# Altium schematic sheet L-Stick_sheet2_mcu.SchDoc: L-Stick - nRF MCU
size A4; DocumentNumber: 2; Revision: 1.0.0; SheetNumber: 2; SheetTotal: 5; DrawnBy: SU; DocumentSize: A4; PCAName: L-Stick
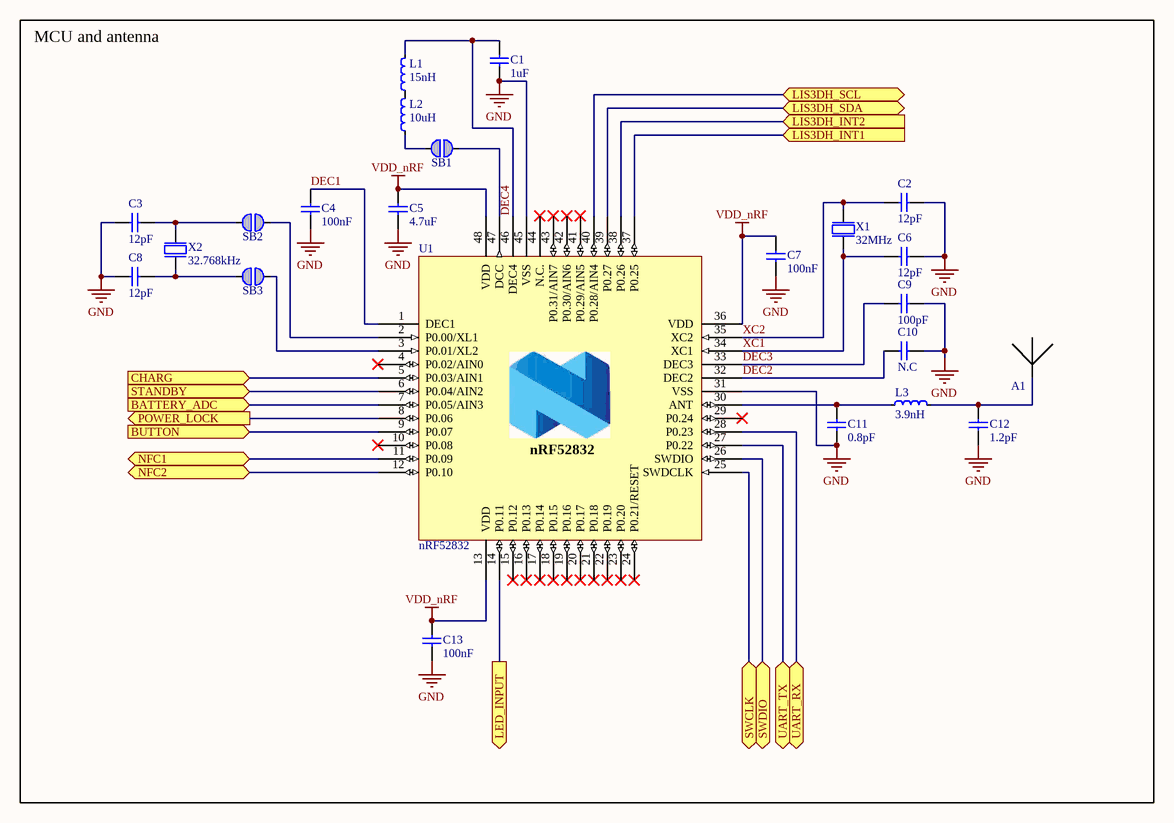
[diagram p0: L-Stick_sheet2_mcu.SchDoc]

## Parts
A1  (no value)  [Antenna]  (no BOM)
C1  1uF  [0603C]
C2  12pF  [0402C]
C3  12pF  [0402C]
C4  100nF  [0402C]
C5  4.7uF  [0603C]
C6  12pF  [0402C]
C7  100nF  [0402C]
C8  12pF  [0402C]
C9  100pF  [0402C]
C10  N.C  [0402C]
C11  0.8pF  [0402C]
C12  1.2pF  [0402C]
C13  100nF  [0402C]
L1  15nH  [0402L]
L2  10uH  [0603L]
L3  3.9nH  [0402L]
SB1  Solderbridge  [Solderbridge]  (value not drawn)  (no BOM)
SB2  Solderbridge  [Solderbridge]  (value not drawn)  (no BOM)
SB3  Solderbridge  [Solderbridge]  (value not drawn)  (no BOM)
U1  nRF52832  [QFN40P600X600X90-48N]
X1  32MHz  [XTAL_2016]
X2  32.768kHz  [XTAL_2012]

## Blocks framed on the sheet
MCU and antenna: A1 C1-C13 L1-L3 SB1-SB3 U1 X1 X2

## Ports
BATTERY_ADC (in), BUTTON (in), CHARG (in), LED_INPUT (out), LIS3DH_INT1 (in), LIS3DH_INT2 (in), LIS3DH_SCL (bidir), LIS3DH_SDA (bidir), NFC1 (bidir), NFC2 (bidir), POWER_LOCK (out), STANDBY (in), SWCLK (bidir), SWDIO (bidir), UART_RX (bidir), UART_TX (bidir)

## Nets
GND: C1.1 C2.2 C3.1 C4.1 C5.1 C6.2 C7.1 C8.1 C9.2 C10.2 C11.1 C12.1 C13.1 U1.31(VSS) U1.45(VSS) U1.49(GND) X1.2(GND) X1.4(GND)
VDD_nRF: C5.2 C7.2 C13.2 U1.13(VDD) U1.36(VDD) U1.48(VDD)
BATTERY_ADC: U1.7(P0.05/AIN3) ; port BATTERY_ADC
BUTTON: U1.9(P0.07) ; port BUTTON
CHARG: U1.5(P0.03/AIN1) ; port CHARG
DEC1: C4.2 U1.1(DEC1)
DEC2: C10.1 U1.32(DEC2)
DEC3: C9.1 U1.33(DEC3)
DEC4: C1.2 L1.2 U1.46(DEC4)
LED_INPUT: U1.14(P0.11) ; port LED_INPUT
LIS3DH_INT1: U1.37(P0.25) ; port LIS3DH_INT1
LIS3DH_INT2: U1.38(P0.26) ; port LIS3DH_INT2
LIS3DH_SCL: U1.40(P0.28/AIN4) ; port LIS3DH_SCL
LIS3DH_SDA: U1.39(P0.27) ; port LIS3DH_SDA
NFC1: U1.11(P0.09) ; port NFC1
NFC2: U1.12(P0.10) ; port NFC2
POWER_LOCK: U1.8(P0.06) ; port POWER_LOCK
STANDBY: U1.6(P0.04/AIN2) ; port STANDBY
SWCLK: U1.25(SWDCLK) ; port SWCLK
SWDIO: U1.26(SWDIO) ; port SWDIO
UART_RX: U1.28(P0.23) ; port UART_RX
UART_TX: U1.27(P0.22) ; port UART_TX
XC1: C6.1 U1.34(XC1) X1.1(inp)
XC2: C2.1 U1.35(XC2) X1.3(out)
NetA1_1: A1.1 C12.2 L3.2
NetC3_2: C3.2 SB2.1 X2.2(out)
NetC8_2: C8.2 SB3.1 X2.1(inp)
NetC11_2: C11.2 L3.1 U1.30(ANT)
NetL1_1: L1.1 L2.2
NetL2_1: L2.1 SB1.1
NetSB1_2: SB1.2 U1.47(DCC)
NetSB2_2: SB2.2 U1.2(P0.00/XL1)
NetSB3_2: SB3.2 U1.3(P0.01/XL2)

Not connected (* = marked no-connect by the designer): U1 4(P0.02/AIN0)* 10(P0.08)* 15(P0.12)* 16(P0.13)* 17(P0.14)* 18(P0.15)* 19(P0.16)* 20(P0.17)* 21(P0.18)* 22(P0.19)* 23(P0.20)* 24(P0.21/RESET)* 29(P0.24)* 41(P0.29/AIN5)* 42(P0.30/AIN6)* 43(P0.31/AIN7)* 44(N.C.)*

## Notes on the sheet
- Title
- Size:
- Date:
- A4
- Number:
- Time:
- Revision:
- Sheet
- of
- File:

## Library data of the parts
A1 = Antenna: 2.45 GHz PCB antenna
C1 C5 = CAP_0603: Capacitor
  C1: Value: 1uF
  C5: Value: 4.7uF
C2-C4 C6-C13 = CAP_0402: Capacitor
  C2 C3 C6 C8: Value: 12pF
  C4 C7 C13: Value: 100nF
  C9: Value: 100pF
  C10: Value: N.C
  C11: Value: 0.8pF
  C12: Value: 1.2pF
L1 L3 = IND_0402: Inductor
  L1: Value: 15nH
  L3: Value: 3.9nH
L2 = IND_0603: Inductor; Value: 10uH
U1 = nRF52832_QFAA: Chip, nRF52832, Multi-protocol Bluetooth Low Energy, ANT and 2.4GHz proprietary system-on-chip; Value: nRF52832
X1 = XTAL_SMD2016: XTAL SMD 2016, 32MHz, Cl=8pF, Tot: ±40ppm; Value: 32MHz
X2 = XTAL_SMD2012: XTAL SMD 2012, 32.768kHz, 9pF, ±20ppm; Value: 32.768kHz
SB1-SB3 = SOLDERBRIDGE: Value: Solderbridge